# Altium project stm32f103.PrjPcb
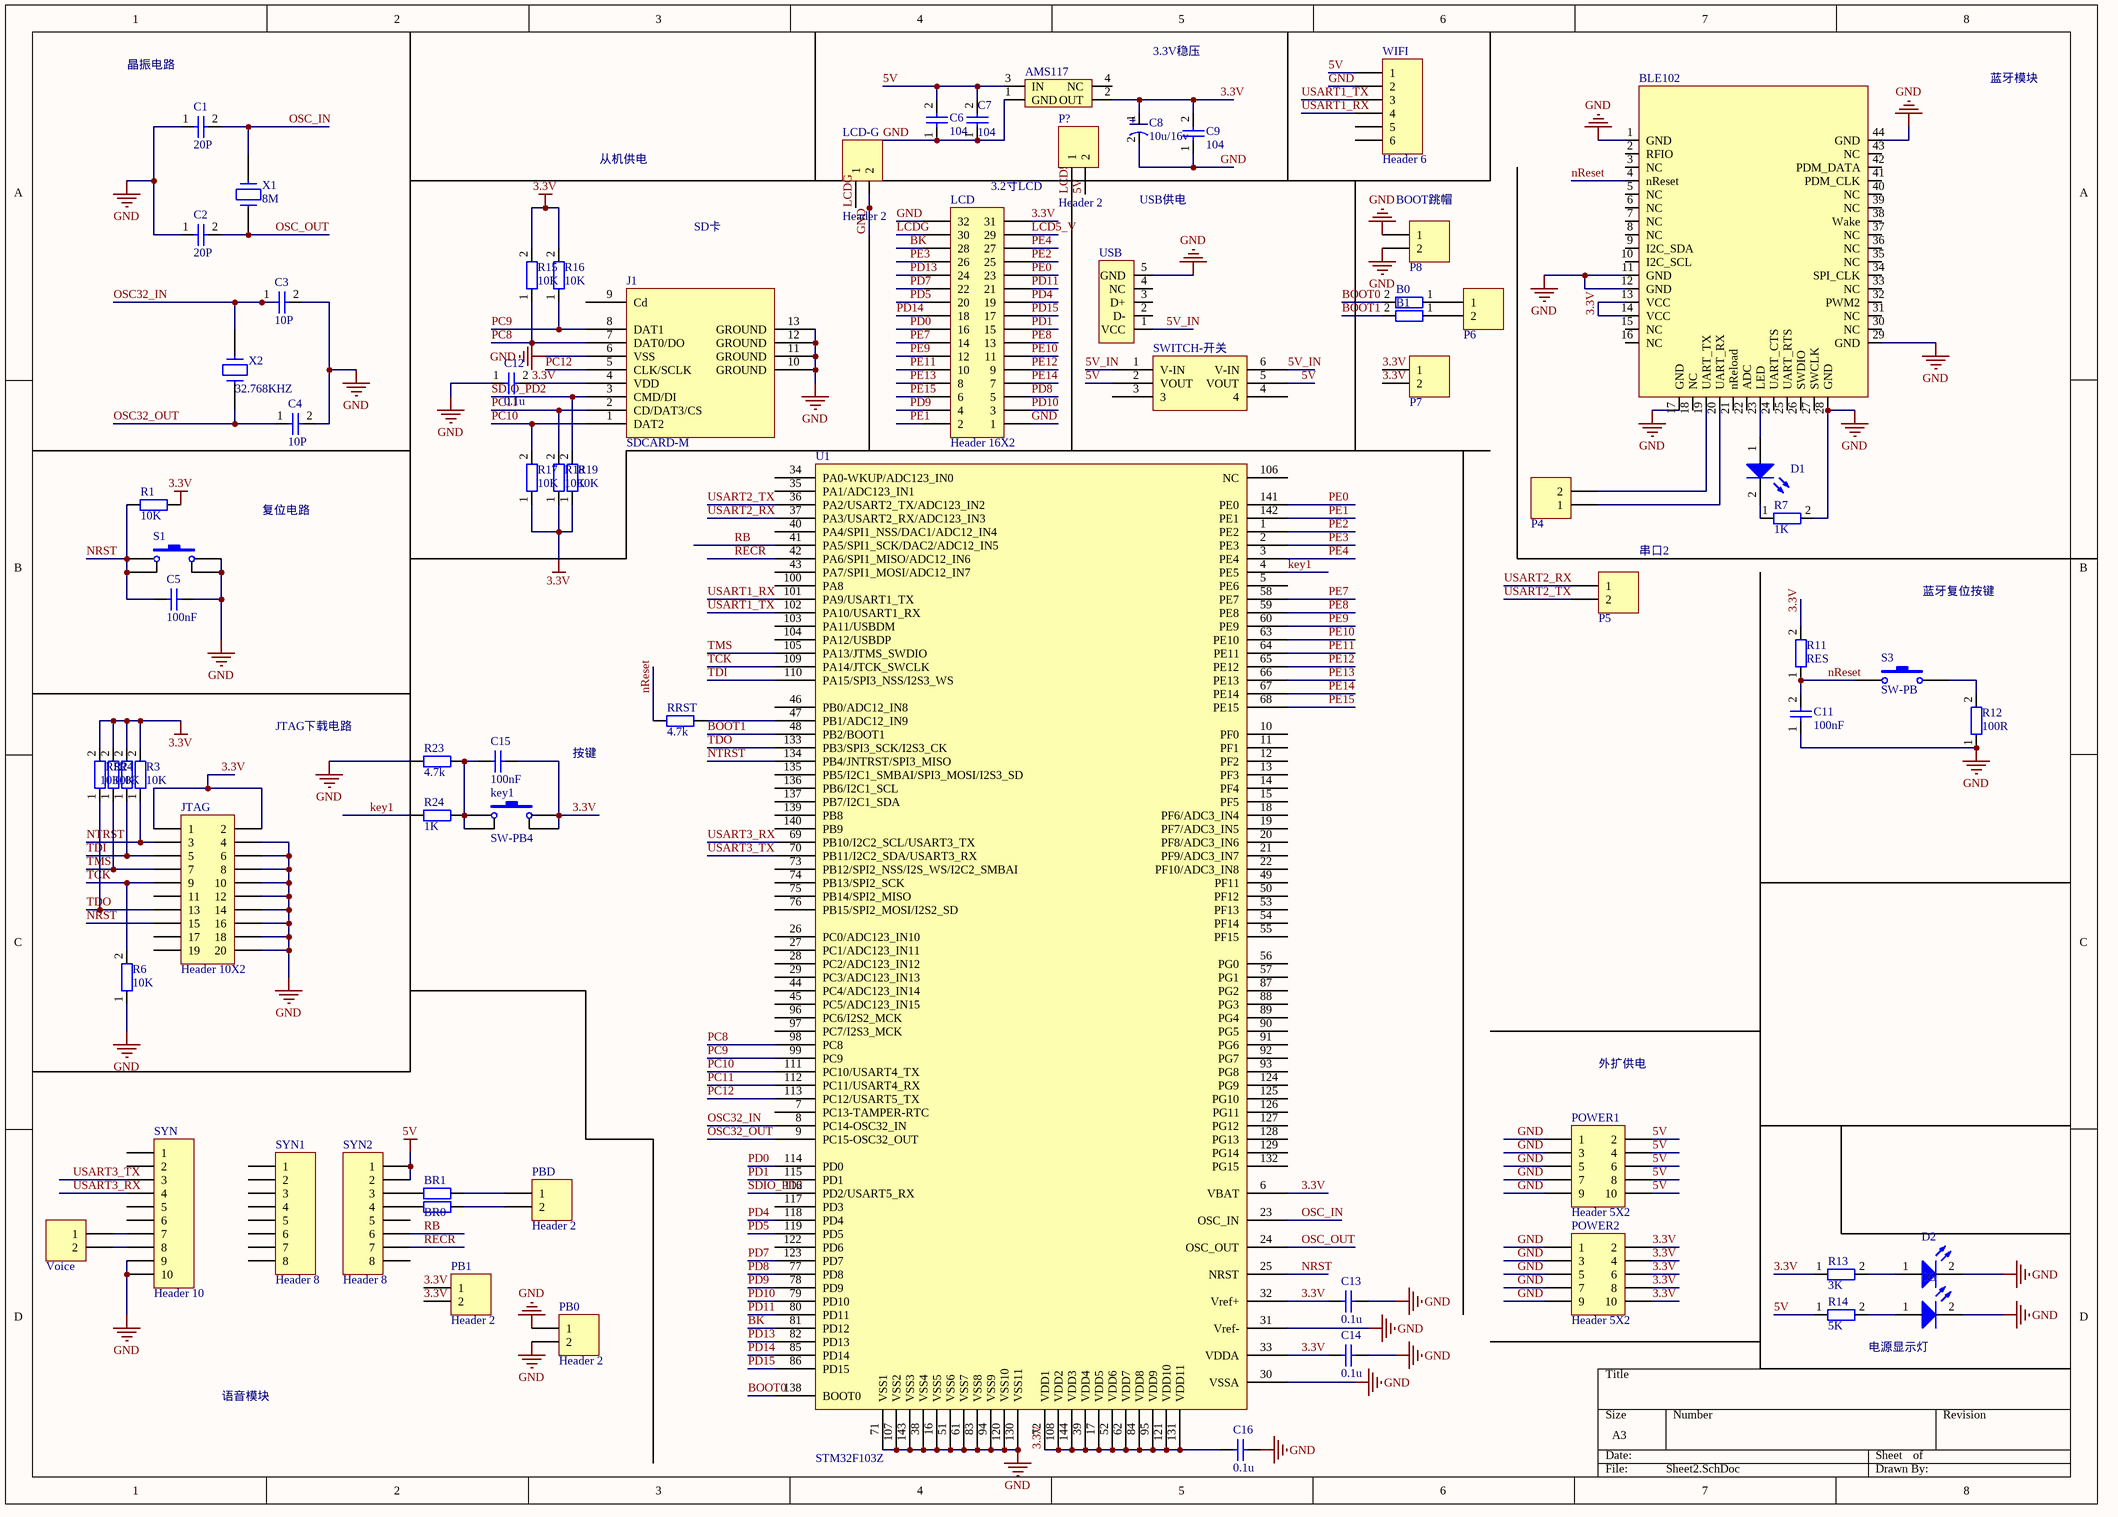
[diagram p0: Sheet2.SchDoc]
1 sheet, 71 parts. Net scope: global (net labels, ports and power ports of the same name join across sheets).
Board files: PCB2.PcbDoc, PCB1.PcbDoc

## Sheet Sheet2.SchDoc
size A3

### Parts
AMS117  (no value)  [ASM117稳压芯片]
B0  10K  [0805-有丝印]  (value not drawn)
B1  10K  [0805-有丝印]  (value not drawn)
BLE102  (no value)  [WH-BLE102-V1.1]
BR0  1k  [0805-1]  (value not drawn)
BR1  1k  [0805-1]  (value not drawn)
C1  20P  [0805-有丝印]
C2  20P  [0805-有丝印]
C3  10P  [0805-有丝印]
C4  10P  [0805-有丝印]
C5  value 100nF  [0805-2]  (hidden comment: 0.1UF)
C6  104  [0805-有丝印]
C7  104  [0805-有丝印]
C8  10u/16v  [SMD-EC-F3]
C9  104  [0805-有丝印]
C11  100nF  [0805-有丝印]
C12  0.1u  [0805-有丝印]
C13  0.1u  [C-RAD-0603]
C14  0.1u  [C-RAD-0603]
C15  value 100nF  [1206]  (hidden comment: 104)
C16  value 0.1u  [C-RAD-0603]  (hidden comment: Cap)
D1  (no value)  [贴片0805-有丝印]
D2  (no value)  [贴片0805-有丝印]
D3  (no value)  [贴片0805-有丝印]
J1  SDCARD-M  [SDCARD-M]
JTAG  Header 10X2  [HDR10X2_A1]
key1  SW-PB4  [SW_PB4_A1]
LCD  Header 16X2  [HDR16X2]
LCD-G  Header 2  [HDR1X2]
P4  Header 2  [HDR1X2]  (value not drawn)
P5  Header 2  [HDR1X2]  (value not drawn)
P6  Header 2  [HDR1X2]  (value not drawn)
P7  Header 2  [HDR1X2]  (value not drawn)
P8  Header 2  [HDR1X2]  (value not drawn)
P?  Header 2  [HDR1X2]
PB0  Header 2  [HDR1X2]
PB1  Header 2  [HDR1X2]
PBD  Header 2  [HDR1X2]
POWER1  Header 5X2  [HDR5X2_A1]
POWER2  Header 5X2  [HDR5X2_A1]
R1  10K  [0805-1]
R2  10K  [0805-有丝印]
R3  10K  [0805-有丝印]
R4  10K  [0805-有丝印]
R5  10K  [0805-有丝印]
R6  10K  [0805-有丝印]
R7  1K  [0805-有丝印]
R11  RES  [0805-有丝印]
R12  100R  [0805-有丝印]
R13  3K  [0805-有丝印]
R14  5K  [0805-有丝印]
R15  10K  [0805-有丝印]
R16  10K  [0805-有丝印]
R17  10K  [0805-有丝印]
R18  10K  [0805-有丝印]
R19  10K  [0805-有丝印]
R23  4.7k  [0805-1]
R24  1k  [0805-1]
RRST  4.7k  [0805-1]
S1  (no value)  [贴片按键]
S3  SW-PB  [SW_PB2_A1]
SWITCH-开关  (no value)  [switch开关]
SYN  Header 10  [DIP20]
SYN1  Header 8  [DIP16 - duplicate1]
SYN2  Header 8  [DIP16 - duplicate1]
U1  STM32F103Z  [STM32f103zet6]
USB  (no value)  [USB2.0]
Voice  Header 2  [HDR2X1_A]  (value not drawn)
WIFI  Header 6  [HDR6X1_A]
X1  8M  [XTAL-Y贴片晶振]
X2  32.768KHZ  [CRYS-3X8]

### Nets
3.3V: AMS117.2(OUT) BLE102.13(VCC) BLE102.14(VCC) C8.1 C9.2 C12.2 C13.1 C14.1 C15.2 C16.1 J1.4(VDD) JTAG.1 JTAG.2 key1.2 key1.3 LCD.31 P7.1 P7.2 PB1.1 PB1.2 POWER2.2 POWER2.4 POWER2.6 POWER2.8 POWER2.10 R1.2 R2.2 R3.2 R4.2 R5.2 R11.2 R13.1 R15.2 R16.2 R17.1 R18.1 R19.1 U1.6(VBAT) U1.17(VDD5) U1.32(Vref+) U1.33(VDDA) U1.39(VDD4) U1.52(VDD6) U1.62(VDD7) U1.72(VDD1) U1.84(VDD8) U1.95(VDD9) U1.108(VDD2) U1.121(VDD10) U1.131(VDD11) U1.144(VDD3)
5V: AMS117.3(IN) C6.2 C7.2 P?.2 POWER1.2 POWER1.4 POWER1.6 POWER1.8 POWER1.10 R14.1 SWITCH-开关.2(VOUT) SWITCH-开关.5(VOUT) SYN2.1 SYN2.2 WIFI.1
GND: AMS117.1(GND) BLE102.1(GND) BLE102.11(GND) BLE102.12(GND) BLE102.17(GND) BLE102.28(GND) BLE102.29(GND) BLE102.44(GND) C1.1 C2.1 C3.2 C4.2 C5.2 C6.1 C7.1 C8.2 C9.1 C11.1 C12.1 C13.2 C14.2 C16.2 D2.2(K) D3.2(K) J1.6(VSS) J1.10(GROUND) J1.11(GROUND) J1.12(GROUND) J1.13(GROUND) JTAG.4 JTAG.6 JTAG.8 JTAG.10 JTAG.12 JTAG.14 JTAG.16 JTAG.18 JTAG.20 LCD.1 LCD.32 LCD-G.2 P8.1 P8.2 PB0.1 PB0.2 POWER1.1 POWER1.3 POWER1.5 POWER1.7 POWER1.9 POWER2.1 POWER2.3 POWER2.5 POWER2.7 POWER2.9 R6.1 R7.2 R12.1 R23.1 S1.2 S1.3 SYN.9 SYN.10 U1.16(VSS5) U1.30(VSSA) U1.31(Vref-) U1.38(VSS4) U1.51(VSS6) U1.61(VSS7) U1.71(VSS1) U1.83(VSS8) U1.94(VSS9) U1.107(VSS2) U1.120(VSS10) U1.130(VSS11) U1.143(VSS3) USB.5(GND) WIFI.2
5V_IN: SWITCH-开关.1(V-IN) SWITCH-开关.6(V-IN) USB.1(VCC)
BK: LCD.28 U1.81(PD12)
BOOT0: B0.2 U1.138(BOOT0)
BOOT1: B1.2 U1.48(PB2/BOOT1)
key1: R24.1 U1.4(PE5)
LCD5_V: LCD.29 P?.1
LCDG: LCD.30 LCD-G.1
nReset: BLE102.4(nReset) C11.2 R11.1 RRST.1 S3.1
NRST: C5.1 JTAG.15 R1.1 S1.1 S1.4 U1.25(NRST)
NTRST: JTAG.3 R3.1 U1.134(PB4/JNTRST/SPI3_MISO)
OSC32_IN: C3.1 U1.8(PC14-OSC32_IN) X2.2
OSC32_OUT: C4.1 U1.9(PC15-OSC32_OUT) X2.1
OSC_IN: C1.2 U1.23(OSC_IN) X1.2
OSC_OUT: C2.2 U1.24(OSC_OUT) X1.1
PC8: J1.7(DAT0/DO) R15.1 U1.98(PC8)
PC9: J1.8(DAT1) R16.1 U1.99(PC9)
PC10: J1.1(DAT2) R17.2 U1.111(PC10/USART4_TX)
PC11: J1.2(CD/DAT3/CS) R18.2 U1.112(PC11/USART4_RX)
PC12: J1.5(CLK/SCLK) U1.113(PC12/USART5_TX)
PD0: LCD.16 U1.114(PD0)
PD1: LCD.15 U1.115(PD1)
PD4: LCD.19 U1.118(PD4)
PD5: LCD.20 U1.119(PD5)
PD7: LCD.22 U1.123(PD7)
PD8: LCD.5 U1.77(PD8)
PD9: LCD.4 U1.78(PD9)
PD10: LCD.3 U1.79(PD10)
PD11: LCD.21 U1.80(PD11)
PD13: LCD.24 U1.82(PD13)
PD14: LCD.18 U1.85(PD14)
PD15: LCD.17 U1.86(PD15)
PE0: LCD.23 U1.141(PE0)
PE1: LCD.2 U1.142(PE1)
PE2: LCD.25 U1.1(PE2)
PE3: LCD.26 U1.2(PE3)
PE4: LCD.27 U1.3(PE4)
PE7: LCD.14 U1.58(PE7)
PE8: LCD.13 U1.59(PE8)
PE9: LCD.12 U1.60(PE9)
PE10: LCD.11 U1.63(PE10)
PE11: LCD.10 U1.64(PE11)
PE12: LCD.9 U1.65(PE12)
PE13: LCD.8 U1.66(PE13)
PE14: LCD.7 U1.67(PE14)
PE15: LCD.6 U1.68(PE15)
RB: SYN2.6 U1.41(PA5/SPI1_SCK/DAC2/ADC12_IN5)
RECR: SYN2.7 U1.42(PA6/SPI1_MISO/ADC12_IN6)
SDIO_PD2: J1.3(CMD/DI) R19.2 U1.116(PD2/USART5_RX)
TCK: JTAG.9 R6.2 U1.109(PA14/JTCK_SWCLK)
TDI: JTAG.5 R2.1 U1.110(PA15/SPI3_NSS/I2S3_WS)
TDO: JTAG.13 R5.1 U1.133(PB3/SPI3_SCK/I2S3_CK)
TMS: JTAG.7 R4.1 U1.105(PA13/JTMS_SWDIO)
USART1_RX: U1.101(PA9/USART1_TX) WIFI.4
USART1_TX: U1.102(PA10/USART1_RX) WIFI.3
USART2_RX: P5.1 U1.37(PA3/USART2_RX/ADC123_IN3)
USART2_TX: P5.2 U1.36(PA2/USART2_TX/ADC123_IN2)
USART3_RX: SYN.4 U1.69(PB10/I2C2_SCL/USART3_TX)
USART3_TX: SYN.3 U1.70(PB11/I2C2_SDA/USART3_RX)
NetB0_1: B0.1 P6.1
NetB1_1: B1.1 P6.2
NetBLE102_19: BLE102.19(UART_TX) P4.2
NetBLE102_20: BLE102.20(UART_RX) P4.1
NetBLE102_23: BLE102.23(LED) D1.1(A)
NetBR0_1: BR0.1 SYN2.4
NetBR0_2: BR0.2 PBD.2
NetBR1_1: BR1.1 SYN2.3
NetBR1_2: BR1.2 PBD.1
NetC15_1: C15.1 key1.1 key1.4 R23.2 R24.2
NetD1_2: D1.2(K) R7.1
NetD2_1: D2.1(A) R13.2
NetD3_1: D3.1(A) R14.2
NetR12_2: R12.2 S3.2
NetRRST_2: RRST.2 U1.47(PB1/ADC12_IN9)
NetSYN_7: SYN.7 Voice.1
NetSYN_8: SYN.8 Voice.2

Not connected (* = marked no-connect by the designer): AMS117 4(NC); BLE102 2(RFIO) 3(NC) 5(NC) 6(NC) 7(NC) 8(NC) 9(I2C_SDA) 10(I2C_SCL) 15(NC) 16(NC) 18(NC) 21(nReload) 22(ADC) 24(UART_CTS) 25(UART_RTS) 26(SWDIO) 27(SWCLK) 30(NC) 31(NC) 32(PWM2) 33(NC) 34(SPI_CLK) 35(NC) 36(NC) 37(NC) 38(Wake) 39(NC) 40(NC) 41(PDM_CLK) 42(PDM_DATA) 43(NC); J1 9(Cd); JTAG 11 17 19; SWITCH-开关 3 4; SYN 1 2 5 6; SYN1 1 2 3 4 5 6 7 8; SYN2 5 8; U1 5(PE6) 7(PC13-TAMPER-RTC) 10(PF0) 11(PF1) 12(PF2) 13(PF3) 14(PF4) 15(PF5) 18(PF6/ADC3_IN4) 19(PF7/ADC3_IN5) 20(PF8/ADC3_IN6) 21(PF9/ADC3_IN7) 22(PF10/ADC3_IN8) 26(PC0/ADC123_IN10) 27(PC1/ADC123_IN11) 28(PC2/ADC123_IN12) 29(PC3/ADC123_IN13) 34(PA0-WKUP/ADC123_IN0) 35(PA1/ADC123_IN1) 40(PA4/SPI1_NSS/DAC1/ADC12_IN4) 43(PA7/SPI1_MOSI/ADC12_IN7) 44(PC4/ADC123_IN14) 45(PC5/ADC123_IN15) 46(PB0/ADC12_IN8) 49(PF11) 50(PF12) 53(PF13) 54(PF14) 55(PF15) 56(PG0) 57(PG1) 73(PB12/SPI2_NSS/I2S_WS/I2C2_SMBAI) 74(PB13/SPI2_SCK) 75(PB14/SPI2_MISO) 76(PB15/SPI2_MOSI/I2S2_SD) 87(PG2) 88(PG3) 89(PG4) 90(PG5) 91(PG6) 92(PG7) 93(PG8) 96(PC6/I2S2_MCK) 97(PC7/I2S3_MCK) 100(PA8) 103(PA11/USBDM) 104(PA12/USBDP) 106(NC) 117(PD3) 122(PD6) 124(PG9) 125(PG10) 126(PG11) 127(PG12) 128(PG13) 129(PG14) 132(PG15) 135(PB5/I2C1_SMBAI/SPI3_MOSI/I2S3_SD) 136(PB6/I2C1_SCL) 137(PB7/I2C1_SDA) 139(PB8) 140(PB9); USB 2(D-) 3(D+) 4(NC); WIFI 5 6

### Notes on the sheet
- 晶振电路
- 3.3V稳压
- 蓝牙模块
- 从机供电
- SD卡
- 3.2寸LCD
- USB供电
- (near P8) BOOT跳帽
- 复位电路
- (near P5) 串口2
- 蓝牙复位按键
- JTAG下载电路
- 按键
- 外扩供电
- 电源显示灯
- 语音模块

### Library data of the parts
AMS117 = AMS117
B0 B1 R2-R7 R12-R19 = RES
BLE102 = WH-BLE102-V1.1
BR0 BR1 R1 R23 R24 RRST = Res1: 贴片电阻; Published: 8-Jun-2000; LatestRevisionDate: 17-Jul-2002; LatestRevisionNote: Re-released for DXP Platform.; PackageReference: AXIAL-0.4; Publisher: Altium Limited
  BR0 BR1 R24: Value: 1K
  R1: Value: 10K
  R23 RRST: Value: 4.7k
C1-C4 C6 C7 C9 C11 C12 = CAP
C5 C13-C16 = Cap: 无极性电容; Published: 8-Jun-2000; LatestRevisionDate: 17-Jul-2002; LatestRevisionNote: Re-released for DXP Platform.; PackageReference: RAD-0.3; Publisher: Altium Limited
  C13 C14: Value: 0.1u
C8 = CAP-电解电容
D1-D3 = LED
J1 = SDCARD-M: TF卡槽
JTAG = Header 10X2: Header, 10-Pin; LatestRevisionDate: 17-Jul-2002; LatestRevisionNote: Re-released for DXP Platform.; Publisher: Altium Limited
key1 S1 = SW-PB4: 微动开关; Published: 24-Mar-1999; LatestRevisionDate: 17-Jul-2002; LatestRevisionNote: Re-released for DXP Platform.; PackageReference: SPST-2; Publisher: Altium Limited
LCD = Header 16X2: 接插件; LatestRevisionDate: 17-Jul-2002; LatestRevisionNote: Re-released for DXP Platform.; Publisher: Altium Limited
LCD-G P? PB0 PB1 PBD = Header 2: Header, 2-Pin; LatestRevisionDate: 17-Jul-2002; LatestRevisionNote: Re-released for DXP Platform.; Publisher: Altium Limited
P4-P8 Voice = Header 2: 接插件; LatestRevisionDate: 17-Jul-2002; LatestRevisionNote: Re-released for DXP Platform.; Publisher: Altium Limited
POWER1 POWER2 = Header 5X2: 接插件; LatestRevisionDate: 17-Jul-2002; LatestRevisionNote: Re-released for DXP Platform.; Publisher: Altium Limited
S3 = SW-PB: 微动开关; Published: 24-Mar-1999; LatestRevisionDate: 17-Jul-2002; LatestRevisionNote: Re-released for DXP Platform.; PackageReference: SPST-2; Publisher: Altium Limited
SWITCH-开关 = SWITCH-开关
SYN = Header 10: Header, 10-Pin; LatestRevisionDate: 17-Jul-2002; LatestRevisionNote: Re-released for DXP Platform.; Publisher: Altium Limited
SYN1 SYN2 = Header 8: Header, 8-Pin; LatestRevisionDate: 17-Jul-2002; LatestRevisionNote: Re-released for DXP Platform.; Publisher: Altium Limited
U1 = STM32F103Z: STM32单片机144引脚
USB = USB
WIFI = Header 6: 接插件; LatestRevisionDate: 17-Jul-2002; LatestRevisionNote: Re-released for DXP Platform.; Publisher: Altium Limited
X1 X2 = XTAL-Y-晶振